# Altium project IRBeacon.PrjPcb
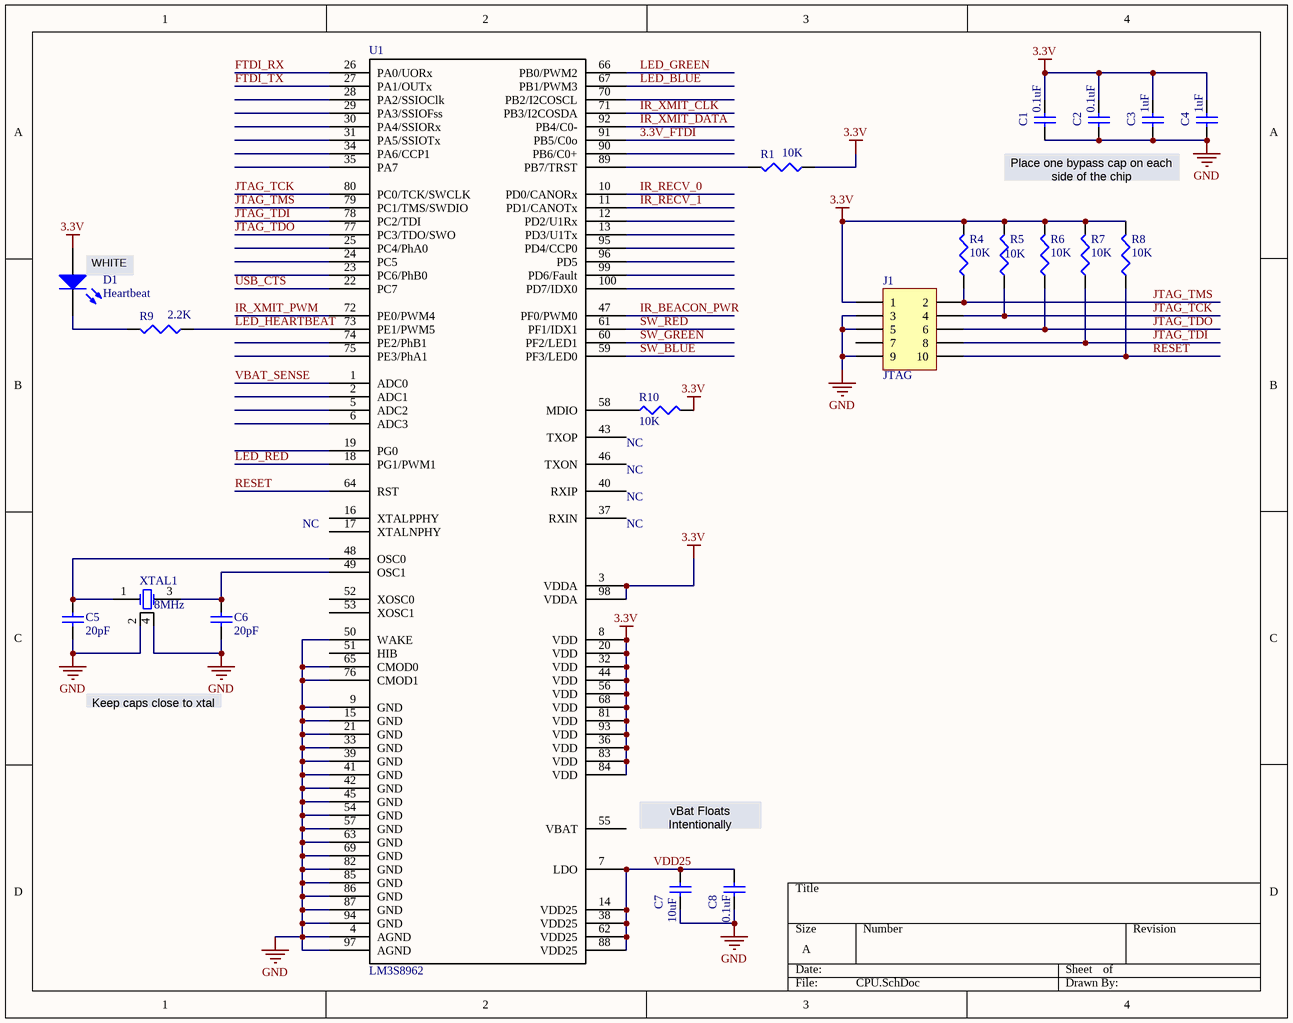
[diagram p0: CPU.SchDoc]
5 sheets, 99 parts. Net scope: global (net labels, ports and power ports of the same name join across sheets).
Board file: IRBeacon.PcbDoc
Sheets:
  CPU.SchDoc
  IRComms.SchDoc
  LEDsButtons.SchDoc
  USBHeaders.SchDoc
  Power.SchDoc

## Sheet CPU.SchDoc
size A; PageSetup: Record=PageOptions|CenterHorizontal=True|CenterVertical=True|PrintScale=1.05|XCorrection=1.00|YCorrection=1.00|PrintKind=1|BorderSize=5000000|LeftOffset=0|BottomOffset=0|Orientation=2|PaperLength=1000|PaperWidth=1000|Scale=100|PaperSource=262|PrintQuality=600|MediaType=1|DitherType=10|PaperKind=Letter|PrintScaleMode=1

### Parts
C1  value 0.1uF  [0402]  (hidden comment: Cap Semi)
C2  value 0.1uF  [0402]  (hidden comment: Cap Semi)
C3  value 1uF  [1608[0603]]  (hidden comment: Cap Semi)
C4  value 1uF  [1608[0603]]  (hidden comment: Cap Semi)
C5  value 20pF  [0402]  (hidden comment: Cap Semi)
C6  value 20pF  [0402]  (hidden comment: Cap Semi)
C7  value 10uF  [1608[0603]]  (hidden comment: Cap Semi)
C8  value 0.1uF  [0402]  (hidden comment: Cap Semi)
D1  Heartbeat  [SurfaceMount(603)]
J1  JTAG  [JTAG-10]
R1  value 10K  [J1-0603]  (hidden comment: Res3)
R4  value 10K  [J1-0603]  (hidden comment: Res3)
R5  value 10K  [J1-0603]  (hidden comment: Res3)
R6  value 10K  [J1-0603]  (hidden comment: Res3)
R7  value 10K  [J1-0603]  (hidden comment: Res3)
R8  value 10K  [J1-0603]  (hidden comment: Res3)
R9  value 2.2K  [J1-0603]  (hidden comment: Res3)
R10  value 10K  [J1-0603]  (hidden comment: Res3)
U1  LM3S8962  [LQFP-100]
XTAL1  8MHz  [CRYSTAL]

### Nets
3.3V: C1.2 C2.2 C3.2 C4.2 D1.1(A) J1.1 R1.1 R4.2 R5.2 R6.2 R7.2 R8.2 R10.2 U1.3(VDDA) U1.8(VDD) U1.20(VDD) U1.32(VDD) U1.36(VDD) U1.44(VDD) U1.56(VDD) U1.68(VDD) U1.81(VDD) U1.83(VDD) U1.84(VDD) U1.93(VDD) U1.98(VDDA)
3.3V_FTDI: U1.91(PB5/C0o)
GND: C1.1 C2.1 C3.1 C4.1 C5.1 C6.1 C7.1 C8.1 J1.3 J1.5 J1.9 U1.4(AGND) U1.9(GND) U1.15(GND) U1.21(GND) U1.33(GND) U1.39(GND) U1.41(GND) U1.42(GND) U1.45(GND) U1.50(WAKE) U1.54(GND) U1.57(GND) U1.63(GND) U1.65(CMOD0) U1.69(GND) U1.76(CMOD1) U1.82(GND) U1.85(GND) U1.86(GND) U1.87(GND) U1.94(GND) U1.97(AGND) XTAL1.2(GND) XTAL1.4(GND)
FTDI_RX: U1.26(PA0/UORx)
FTDI_TX: U1.27(PA1/OUTx)
IR_BEACON_PWR: U1.47(PF0/PWM0)
IR_RECV_0: U1.10(PD0/CANORx)
IR_RECV_1: U1.11(PD1/CANOTx)
IR_XMIT_CLK: U1.71(PB3/I2COSDA)
IR_XMIT_DATA: U1.92(PB4/C0-)
IR_XMIT_PWM: U1.72(PE0/PWM4)
JTAG_TCK: J1.4 R5.1 U1.80(PC0/TCK/SWCLK)
JTAG_TDI: J1.8 R7.1 U1.78(PC2/TDI)
JTAG_TDO: J1.6 R6.1 U1.77(PC3/TDO/SWO)
JTAG_TMS: J1.2 R4.1 U1.79(PC1/TMS/SWDIO)
LED_BLUE: U1.67(PB1/PWM3)
LED_GREEN: U1.66(PB0/PWM2)
LED_HEARTBEAT: R9.1 U1.73(PE1/PWM5)
LED_RED: U1.18(PG1/PWM1)
RESET: J1.10 R8.1 U1.64(RST)
SW_BLUE: U1.59(PF3/LED0)
SW_GREEN: U1.60(PF2/LED1)
SW_RED: U1.61(PF1/IDX1)
USB_CTS: U1.22(PC7)
VBAT_SENSE: U1.1(ADC0)
VDD25: C7.2 C8.2 U1.7(LDO) U1.14(VDD25) U1.38(VDD25) U1.62(VDD25) U1.88(VDD25)
NetC5_2: C5.2 U1.48(OSC0) XTAL1.1(OSC1)
NetC6_2: C6.2 U1.49(OSC1) XTAL1.3(OSC2)
NetD1_2: D1.2(K) R9.2
NetR1_2: R1.2 U1.89(PB7/TRST)
NetR10_1: R10.1 U1.58(MDIO)

Not connected (* = marked no-connect by the designer): J1 7; U1 2(ADC1) 5(ADC2) 6(ADC3) 12(PD2/U1Rx) 13(PD3/U1Tx) 16(XTALPPHY) 17(XTALNPHY) 19(PG0) 23(PC6/PhB0) 24(PC5) 25(PC4/PhA0) 28(PA2/SSIOClk) 29(PA3/SSIOFss) 30(PA4/SSIORx) 31(PA5/SSIOTx) 34(PA6/CCP1) 35(PA7) 37(RXIN) 40(RXIP) 43(TXOP) 46(TXON) 51(HIB) 52(XOSC0) 53(XOSC1) 55(VBAT) 70(PB2/I2COSCL) 74(PE2/PhB1) 75(PE3/PhA1) 90(PB6/C0+) 95(PD4/CCP0) 96(PD5) 99(PD6/Fault) 100(PD7/IDX0)

### Notes on the sheet
- Place one bypass cap on each side of the chip
- (near D1) WHITE
- NC
- (near U1) NC
- Keep caps close to xtal
- vBat Floats Intentionally

### Library data of the parts
C1-C8 = Cap Semi: Capacitor (Semiconductor SIM Model); Published: 8-Jun-2000; LatestRevisionDate: 29-May-2009; LatestRevisionNote: IPC-7351 Footprint Added.; PackageReference: C1206; Publisher: Altium Limited; PackageDescription: Chip Capacitor
D1 = LED
J1 = Header 5X2H: Header, 5-Pin, Dual row, Right Angle; LatestRevisionDate: 17-Jul-2002; LatestRevisionNote: Re-released for DXP Platform.; Publisher: Altium Limited
R1 R4-R10 = Res3: Resistor; Published: 8-Jun-2000; LatestRevisionDate: 29-May-2009; LatestRevisionNote: IPC-7351 Footprint Added.; PackageReference: J1-0603; Publisher: Altium Limited; PackageDescription: Chip Resistor
XTAL1 = Crystal

## Sheet IRComms.SchDoc
size A
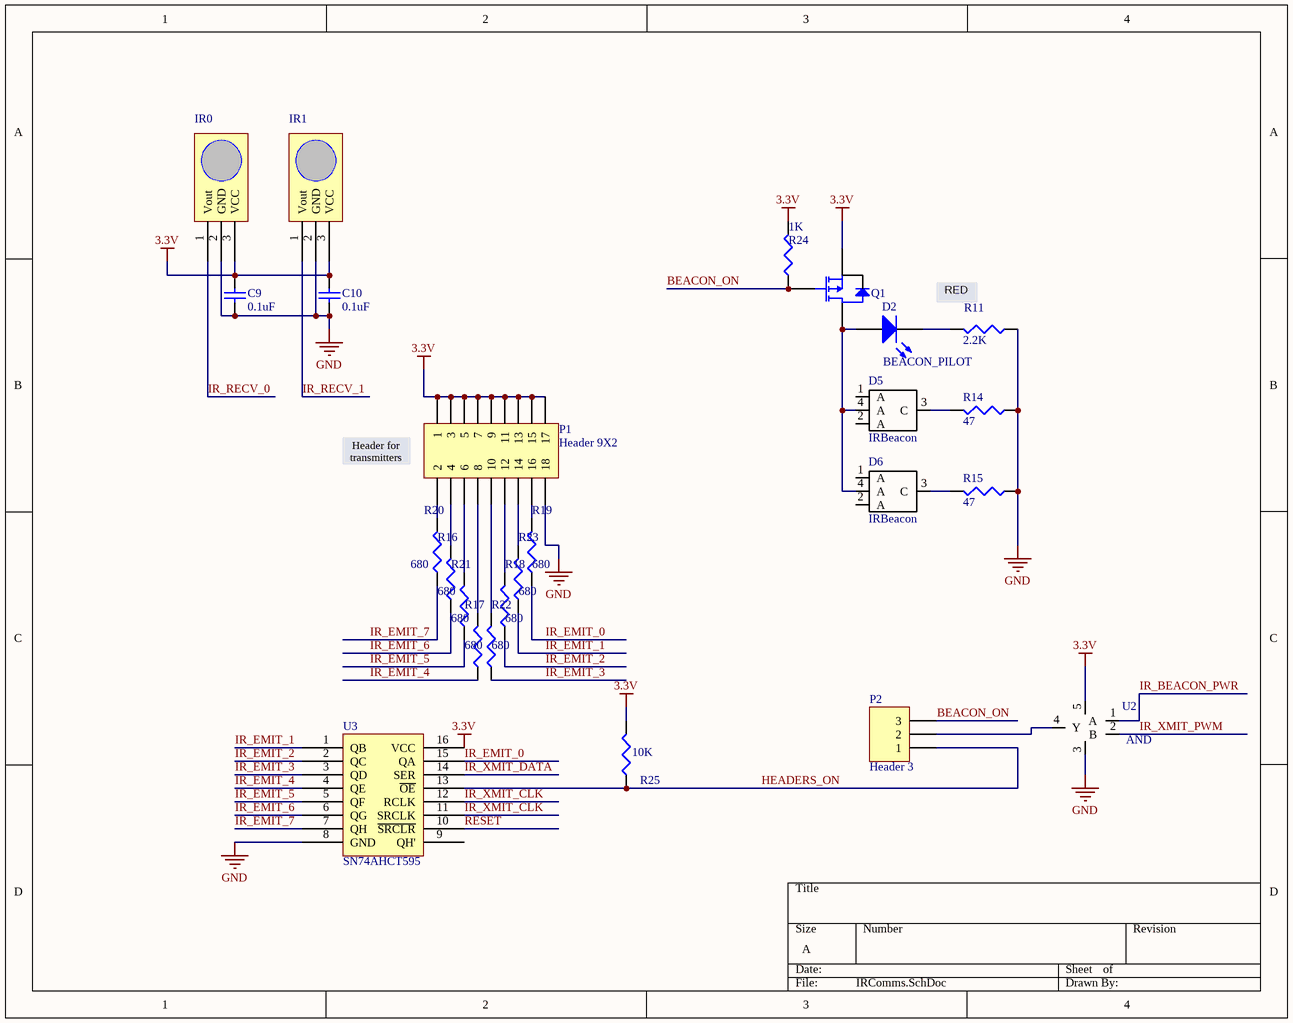
[diagram p1: IRComms.SchDoc]

### Parts
C9  value 0.1uF  [0402]  (hidden comment: Cap Semi)
C10  value 0.1uF  [0402]  (hidden comment: Cap Semi)
D2  BEACON_PILOT  [SurfaceMount(603)]
D5  IRBeacon  [IRBeacon]
D6  IRBeacon  [IRBeacon]
IR0  GP1UX31QS  [GP1UX31QS]  (value not drawn)
IR1  GP1UX31QS  [GP1UX31QS]  (value not drawn)
P1  Header 9X2  [HDR2X9]
P2  Header 3  [HDR1X3]
Q1  P-Mosfet  [SOT-23]  (value not drawn)
R11  value 2.2K  [J1-0603]  (hidden comment: Res3)
R14  value 47  [J1-0603]  (hidden comment: Res3)
R15  value 47  [J1-0603]  (hidden comment: Res3)
R16  value 680  [J1-0603]  (hidden comment: Res3)
R17  value 680  [J1-0603]  (hidden comment: Res3)
R18  value 680  [J1-0603]  (hidden comment: Res3)
R19  value 680  [J1-0603]  (hidden comment: Res3)
R20  value 680  [J1-0603]  (hidden comment: Res3)
R21  value 680  [J1-0603]  (hidden comment: Res3)
R22  value 680  [J1-0603]  (hidden comment: Res3)
R23  value 680  [J1-0603]  (hidden comment: Res3)
R24  value 1K  [J1-0603]  (hidden comment: Res3)
R25  value 10K  [J1-0603]  (hidden comment: Res3)
U2  AND  [SOT-23-5]
U3  SN74AHCT595  [TSSOP-16]

### Nets
3.3V: C9.2 C10.2 IR0.3(VCC) IR1.3(VCC) P1.1 P1.3 P1.5 P1.7 P1.9 P1.11 P1.13 P1.15 P1.17 Q1.2(S) R24.2 R25.2 U2.5(VCC) U3.16(VCC)
GND: C9.1 C10.1 IR0.2(GND) IR1.2(GND) P1.18 R11.1 R14.1 R15.1 U2.3(GND) U3.8(GND)
BEACON_ON: P2.3 Q1.1(G) R24.1
HEADERS_ON: P2.1 R25.1 U3.13(~{OE})
IR_BEACON_PWR: U2.1(A)
IR_EMIT_0: R19.1 U3.15(QA)
IR_EMIT_1: R23.1 U3.1(QB)
IR_EMIT_2: R18.1 U3.2(QC)
IR_EMIT_3: R22.1 U3.3(QD)
IR_EMIT_4: R17.1 U3.4(QE)
IR_EMIT_5: R21.1 U3.5(QF)
IR_EMIT_6: R16.1 U3.6(QG)
IR_EMIT_7: R20.1 U3.7(QH)
IR_RECV_0: IR0.1(Vout)
IR_RECV_1: IR1.1(Vout)
IR_XMIT_CLK: U3.11(SRCLK) U3.12(RCLK)
IR_XMIT_DATA: U3.14(SER)
IR_XMIT_PWM: U2.2(B)
RESET: U3.10(~{SRCLR})
NetD2_1: D2.1(A) D5.4(A) D6.4(A) Q1.3(D)
NetD2_2: D2.2(K) R11.2
NetD5_3: D5.3(C) R14.2
NetD6_3: D6.3(C) R15.2
NetP1_2: P1.2 R20.2
NetP1_4: P1.4 R16.2
NetP1_6: P1.6 R21.2
NetP1_8: P1.8 R17.2
NetP1_10: P1.10 R22.2
NetP1_12: P1.12 R18.2
NetP1_14: P1.14 R23.2
NetP1_16: P1.16 R19.2
NetP2_2: P2.2 U2.4(Y)

Not connected (* = marked no-connect by the designer): D5 1(A) 2(A); D6 1(A) 2(A); U3 9(QH')

### Notes on the sheet
- (near R11) RED
- (near P1) Header for transmitters

### Library data of the parts
C9 C10 = Cap Semi: Capacitor (Semiconductor SIM Model); Published: 8-Jun-2000; LatestRevisionDate: 29-May-2009; LatestRevisionNote: IPC-7351 Footprint Added.; PackageReference: C1206; Publisher: Altium Limited; PackageDescription: Chip Capacitor
D2 = LED
P1 = Header 9X2: Header, 9-Pin, Dual row; LatestRevisionDate: 17-Jul-2002; LatestRevisionNote: Re-released for DXP Platform.; Publisher: Altium Limited
P2 = Header 3: Header, 3-Pin; LatestRevisionDate: 17-Jul-2002; LatestRevisionNote: Re-released for DXP Platform.; Publisher: Altium Limited
R11 R14-R25 = Res3: Resistor; Published: 8-Jun-2000; LatestRevisionDate: 29-May-2009; LatestRevisionNote: IPC-7351 Footprint Added.; PackageReference: J1-0603; Publisher: Altium Limited; PackageDescription: Chip Resistor
U2 = AND_gate: 2 input AND gate
U3 = SN74AHCT595: shift register

## Sheet LEDsButtons.SchDoc
size A
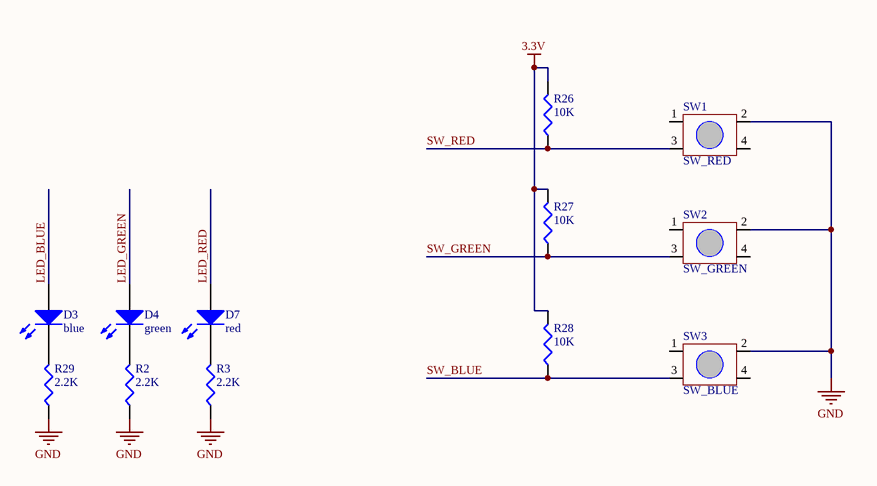
[diagram p2: LEDsButtons.SchDoc]

### Parts
D3  blue  [SurfaceMount(603)]
D4  green  [SurfaceMount(603)]
D7  red  [SurfaceMount(603)]
R2  value 2.2K  [J1-0603]  (hidden comment: Res3)
R3  value 2.2K  [J1-0603]  (hidden comment: Res3)
R26  value 10K  [J1-0603]  (hidden comment: Res3)
R27  value 10K  [J1-0603]  (hidden comment: Res3)
R28  value 10K  [J1-0603]  (hidden comment: Res3)
R29  value 2.2K  [J1-0603]  (hidden comment: Res3)
SW1  SW_RED  [SwitchTall-TL330]
SW2  SW_GREEN  [SwitchTall-TL330]
SW3  SW_BLUE  [SwitchTall-TL330]

### Nets
3.3V: R26.2 R27.2 R28.2
GND: R2.1 R3.1 R29.1 SW1.2 SW2.2 SW3.2
LED_BLUE: D3.1(A)
LED_GREEN: D4.1(A)
LED_RED: D7.1(A)
SW_BLUE: R28.1 SW3.3
SW_GREEN: R27.1 SW2.3
SW_RED: R26.1 SW1.3
NetD3_2: D3.2(K) R29.2
NetD4_2: D4.2(K) R2.2
NetD7_2: D7.2(K) R3.2

Not connected (* = marked no-connect by the designer): SW1 1 4; SW2 1 4; SW3 1 4

### Library data of the parts
D3 D4 D7 = LED
R2 R3 R26-R29 = Res3: Resistor; Published: 8-Jun-2000; LatestRevisionDate: 29-May-2009; LatestRevisionNote: IPC-7351 Footprint Added.; PackageReference: J1-0603; Publisher: Altium Limited; PackageDescription: Chip Resistor
SW1-SW3 = Switch-TL330

## Sheet USBHeaders.SchDoc
size A
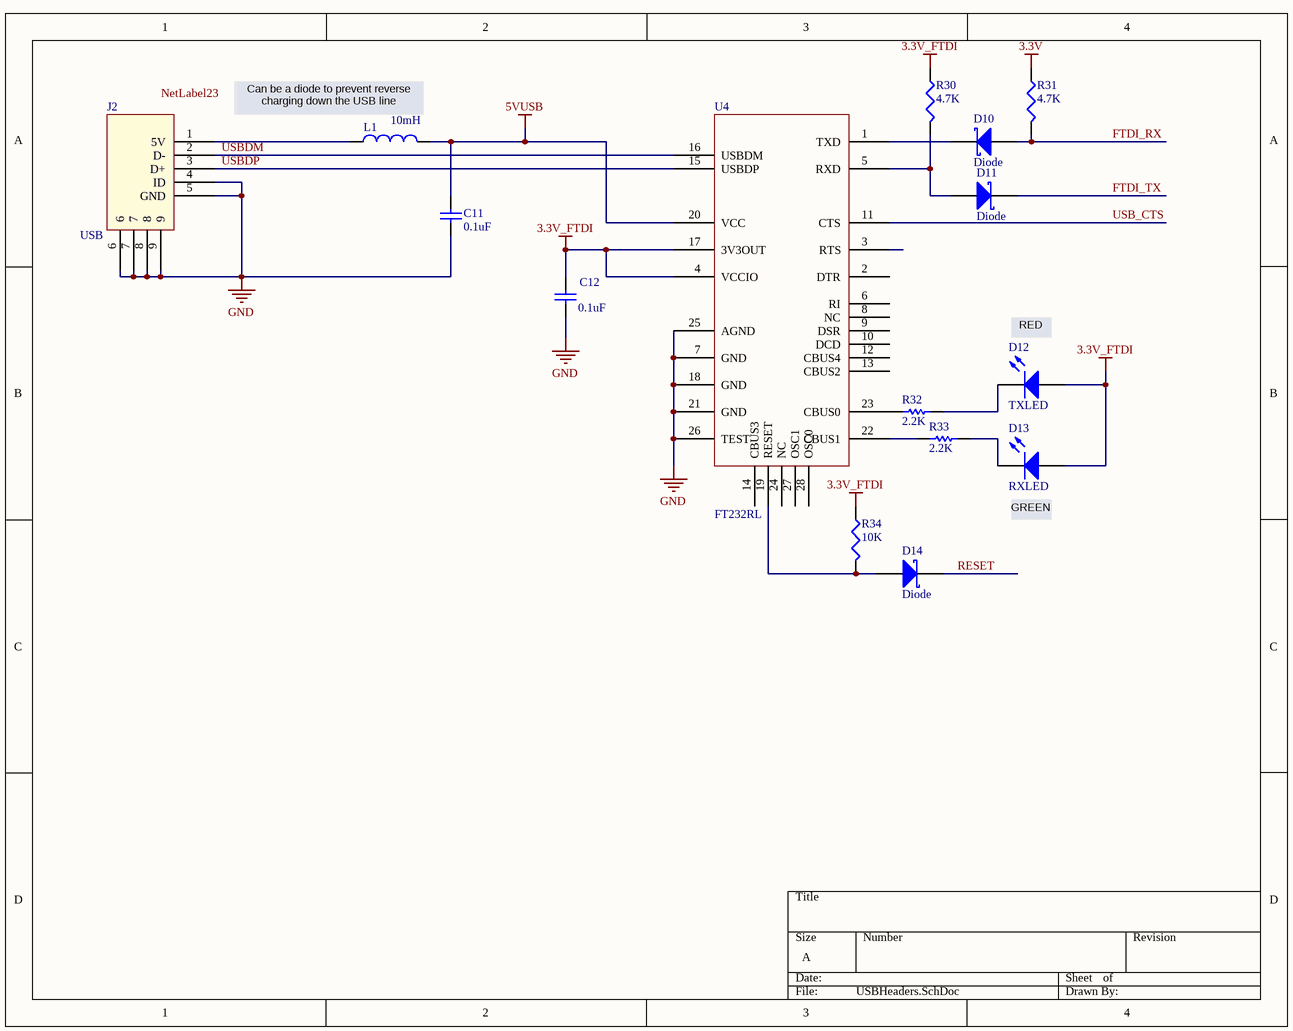
[diagram p3: USBHeaders.SchDoc]

### Parts
C11  value 0.1uF  [0402]
C12  value 0.1uF  [0402]
D10  Diode  [SurfaceMount(603)]
D11  Diode  [SurfaceMount(603)]
D12  TXLED  [SurfaceMount(603)]
D13  RXLED  [SurfaceMount(603)]
D14  Diode  [SurfaceMount(603)]
J2  USB  [USB Minib (thru-hole)]
L1  value 10mH  [2029]  (hidden comment: Inductor)
R30  value 4.7K  [J1-0603]  (hidden comment: Res3)
R31  value 4.7K  [J1-0603]  (hidden comment: Res3)
R32  value 2.2K  [J1-0603]
R33  value 2.2K  [J1-0603]
R34  value 10K  [J1-0603]  (hidden comment: Res3)
U4  FT232RL  [SSOP-28]

### Nets
3.3V: R31.1
3.3V_FTDI: C12.2 D12.1(A) D13.1(A) R30.1 R34.1 U4.4(VCCIO) U4.17(3V3OUT)
5VUSB: C11.2 L1.2 U4.20(VCC)
GND: C11.1 C12.1 J2.4(ID) J2.5(GND) J2.6 J2.7 J2.8 J2.9 U4.7(GND) U4.18(GND) U4.21(GND) U4.25(AGND) U4.26(TEST)
FTDI_RX: D10.2(A) R31.2
FTDI_TX: D11.1(K)
RESET: D14.1(K)
USB_CTS: U4.11(CTS)
USBDM: J2.2(D-) U4.16(USBDM)
USBDP: J2.3(D+) U4.15(USBDP)
NetD10_1: D10.1(K) U4.1(TXD)
NetD11_2: D11.2(A) R30.2 U4.5(RXD)
NetD12_2: D12.2(K) R32.2
NetD13_2: D13.2(K) R33.2
NetD14_2: D14.2(A) R34.2 U4.19(RESET)
NetJ2_1: J2.1(5V) L1.1
NetR32_1: R32.1 U4.23(CBUS0)
NetR33_1: R33.1 U4.22(CBUS1)

Not connected (* = marked no-connect by the designer): U4 2(DTR) 3(RTS) 6(RI) 8(NC) 9(DSR) 10(DCD) 12(CBUS4) 13(CBUS2) 14(CBUS3) 24(NC) 27(OSC1) 28(OSC0)

### Notes on the sheet
- (near L1) Can be a diode to prevent reverse charging down the USB line
- (near D12) RED
- (near D13) GREEN
- Labels drawn without touching a wire or pin: NetLabel23

### Library data of the parts
C11 C12 = Cap: Capacitor; Published: 8-Jun-2000; LatestRevisionDate: 17-Jul-2002; LatestRevisionNote: Re-released for DXP Platform.; PackageReference: RAD-0.3; Publisher: Altium Limited
D10 D11 D14 = SchottkeyDiode
D12 D13 = LED2: Typical RED, GREEN, YELLOW, AMBER GaAs LED; Published: 8-Jun-2000; LatestRevisionDate: 17-Jul-2002; LatestRevisionNote: Re-released for DXP Platform.; PackageVersion: Feb-2002; PackageReference: 3.2X1.6X1.1; Publisher: Altium Limited
J2 = USB-ConnTH
L1 = Inductor: Code_IEC: 1005; Published: 8-Jun-2000; LatestRevisionDate: 29-May-2009; LatestRevisionNote: IPC-7351 Footprint Added.; PackageReference: 0402-A; Publisher: Altium Limited; PackageDescription: Chip Inductor; Code_JEITA: 0402
R30 R31 R34 = Res3: Resistor; Published: 8-Jun-2000; LatestRevisionDate: 29-May-2009; LatestRevisionNote: IPC-7351 Footprint Added.; PackageReference: J1-0603; Publisher: Altium Limited; PackageDescription: Chip Resistor
R32 R33 = Res1: Resistor; Published: 8-Jun-2000; LatestRevisionDate: 17-Jul-2002; LatestRevisionNote: Re-released for DXP Platform.; PackageReference: AXIAL-0.3; Publisher: Altium Limited

## Sheet Power.SchDoc
size A; SheetNumber: roneV11-Power; SheetTotal: 6
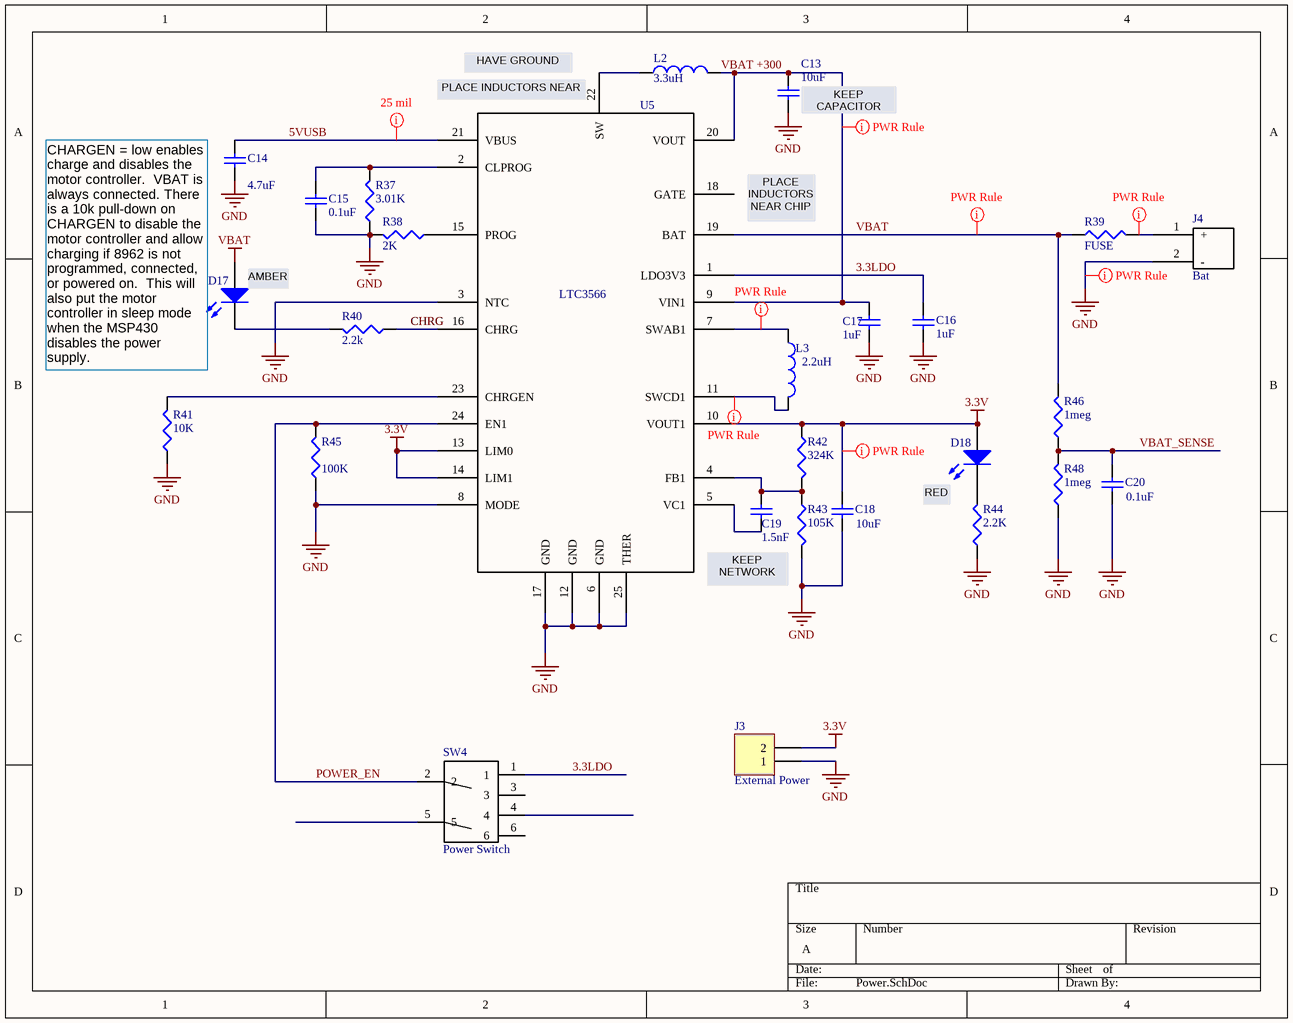
[diagram p4: Power.SchDoc]

### Parts
C13  value 10uF  [CAPC1608L]  (hidden comment: Cap)
C14  value 4.7uF  [CAPC1005L]  (hidden comment: Cap Semi)
C15  value 0.1uF  [CAPC1005L]  (hidden comment: Cap)
C16  value 1uF  [CAPC1608L]  (hidden comment: Cap)
C17  value 1uF  [CAPC1608L]  (hidden comment: Cap)
C18  value 10uF  [CAPC1608L]  (hidden comment: Cap)
C19  value 1.5nF  [CAPC1005L]  (hidden comment: Cap)
C20  value 0.1uF  [CAPC1608L]  (hidden comment: Cap)
D17  Charge  [2029]  (value not drawn)
D18  Power  [2029]  (value not drawn)
J3  External Power  [HDR1X2]
J4  Bat  [BatteryConnJST]
L2  3.3uH  [IndPow]
L3  2.2uH  [IndPow]
R37  value 3.01K  [J1-0603]  (hidden comment: Res3)
R38  value 2K  [J1-0603]  (hidden comment: Res3)
R39  value FUSE  [RESC3225L]  (hidden comment: Res3)
R40  value 2.2k  [J1-0603]  (hidden comment: Res3)
R41  value 10K  [J1-0603]  (hidden comment: Res3)
R42  value 324K  [J1-0603]  (hidden comment: Res3)
R43  value 105K  [J1-0603]  (hidden comment: Res3)
R44  value 2.2K  [J1-0603]  (hidden comment: Res3)
R45  value 100K  [J1-0603]  (hidden comment: Res3)
R46  value 1meg  [J1-0603]  (hidden comment: Res3)
R48  value 1meg  [J1-0603]  (hidden comment: Res3)
SW4  Power Switch  [DPDTSwitch]
U5  LTC3566  [QFN-24]

### Nets
3.3V: C18.2 D18.1(A) J3.2 R42.1 U5.10(VOUT1) U5.13(LIM0) U5.14(LIM1)
5VUSB: C14.2 U5.21(VBUS)
GND: C13.1 C14.1 C15.1 C16.2 C17.2 C18.1 C20.1 J3.1 J4.2(-) R37.1 R38.2 R41.1 R43.2 R44.1 R45.1 R48.1 U5.3(NTC) U5.6(GND) U5.8(MODE) U5.12(GND) U5.17(GND) U5.25(THER)
VBAT: D17.1(A) R39.1 R46.2 U5.19(BAT)
3.3LDO: C16.1 SW4.1 U5.1(LDO3V3)
CHRG: R40.1 U5.16(CHRG)
POWER_EN: R45.2 SW4.2 U5.24(EN1)
VBAT +300: C13.2 C17.1 L2.2 U5.9(VIN1) U5.20(VOUT)
VBAT_SENSE: C20.2 R46.1 R48.2
NetC15_2: C15.2 R37.2 U5.2(CLPROG)
NetC19_1: C19.1 R42.2 R43.1 U5.4(FB1)
NetC19_2: C19.2 U5.5(VC1)
NetD17_2: D17.2(K) R40.2
NetD18_2: D18.2(K) R44.2
NetJ4_1: J4.1(+) R39.2
NetL2_1: L2.1 U5.22(SW)
NetL3_1: L3.1 U5.7(SWAB1)
NetL3_2: L3.2 U5.11(SWCD1)
NetR38_1: R38.1 U5.15(PROG)
NetR41_2: R41.2 U5.23(CHRGEN)

Not connected (* = marked no-connect by the designer): SW4 3 4 5 6; U5 18(GATE)

### Layout directives
rule Width Constraint [Pref Width = 8mil    Min Width = 8mil    Max Width = 25mil]: 5VUSB
rule Width Constraint [Pref Width = 25mil    Min Width = 10mil    Max Width = 50mil]: 3.3V, GND, NetJ4_1, NetL3_1, NetL3_2, VBAT, VBAT +300

### Notes on the sheet
- (near U5) PLACE INDUCTORS NEAR CHIP
- (near U5) HAVE GROUND PLANE
- (near C13) KEEP CAPACITOR CLOSE TO CHIP
- PLACE INDUCTORS NEAR CHIP
- (near D17) AMBER
- CHARGEN = low enables charge and disables the motor controller.  VBAT is always connected. There is a 10k pull-down on CHARGEN to disable the motor controller and allow charging if 8962 is not programmed, connected, or powered on.  This will also put the motor controller in sleep mode when the MSP430 disables the power supply.
- CHRG
- RED
- KEEP NETWORK CLOSE TO CHIP

### Library data of the parts
C13 C15-C20 = Cap: Capacitor; Published: 8-Jun-2000; LatestRevisionDate: 17-Jul-2002; LatestRevisionNote: Re-released for DXP Platform.; PackageReference: RAD-0.3; Publisher: Altium Limited
C14 = Cap Semi: Capacitor (Semiconductor SIM Model); Published: 8-Jun-2000; LatestRevisionDate: 29-May-2009; LatestRevisionNote: IPC-7351 Footprint Added.; PackageReference: C1206; Publisher: Altium Limited; PackageDescription: Chip Capacitor
D17 D18 = LED2: as D12 on sheet USBHeaders; Published: 8-Jun-2000; LatestRevisionDate: 17-Jul-2002; LatestRevisionNote: Re-released for DXP Platform.; PackageVersion: Feb-2002; PackageReference: 3.2X1.6X1.1; Publisher: Altium Limited
J3 = Header 2: Header, 2-Pin; LatestRevisionDate: 17-Jul-2002; LatestRevisionNote: Re-released for DXP Platform.; Publisher: Altium Limited
J4 = BatteryConnJST
L2 L3 = Inductor
  L2: Value: 3.3uH
  L3: Value: 2.2uH
R37-R46 R48 = Res3: Resistor; Published: 8-Jun-2000; LatestRevisionDate: 29-May-2009; LatestRevisionNote: IPC-7351 Footprint Added.; PackageReference: J1-0603; Publisher: Altium Limited; PackageDescription: Chip Resistor
SW4 = DPDTSwitch

## Nets that join several sheets
3.3V: CPU (26 pins), IRComms (18 pins), LEDsButtons (R26.2 R27.2 R28.2), USBHeaders (R31.1), Power (7 pins)
3.3V_FTDI: CPU (U1.91), USBHeaders (7 pins)
5VUSB: USBHeaders (C11.2 L1.2 U4.20), Power (C14.2 U5.21)
GND: CPU (35 pins), IRComms (10 pins), LEDsButtons (6 pins), USBHeaders (13 pins), Power (22 pins)
FTDI_RX: CPU (U1.26), USBHeaders (D10.2 R31.2)
FTDI_TX: CPU (U1.27), USBHeaders (D11.1)
IR_BEACON_PWR: CPU (U1.47), IRComms (U2.1)
IR_RECV_0: CPU (U1.10), IRComms (IR0.1)
IR_RECV_1: CPU (U1.11), IRComms (IR1.1)
IR_XMIT_CLK: CPU (U1.71), IRComms (U3.11 U3.12)
IR_XMIT_DATA: CPU (U1.92), IRComms (U3.14)
IR_XMIT_PWM: CPU (U1.72), IRComms (U2.2)
LED_BLUE: CPU (U1.67), LEDsButtons (D3.1)
LED_GREEN: CPU (U1.66), LEDsButtons (D4.1)
LED_RED: CPU (U1.18), LEDsButtons (D7.1)
RESET: CPU (J1.10 R8.1 U1.64), IRComms (U3.10), USBHeaders (D14.1)
SW_BLUE: CPU (U1.59), LEDsButtons (R28.1 SW3.3)
SW_GREEN: CPU (U1.60), LEDsButtons (R27.1 SW2.3)
SW_RED: CPU (U1.61), LEDsButtons (R26.1 SW1.3)
USB_CTS: CPU (U1.22), USBHeaders (U4.11)
VBAT_SENSE: CPU (U1.1), Power (C20.2 R46.1 R48.2)